# EAGLE schematic SI4844_LCD16x02_setup (EAGLE 9.6.2)
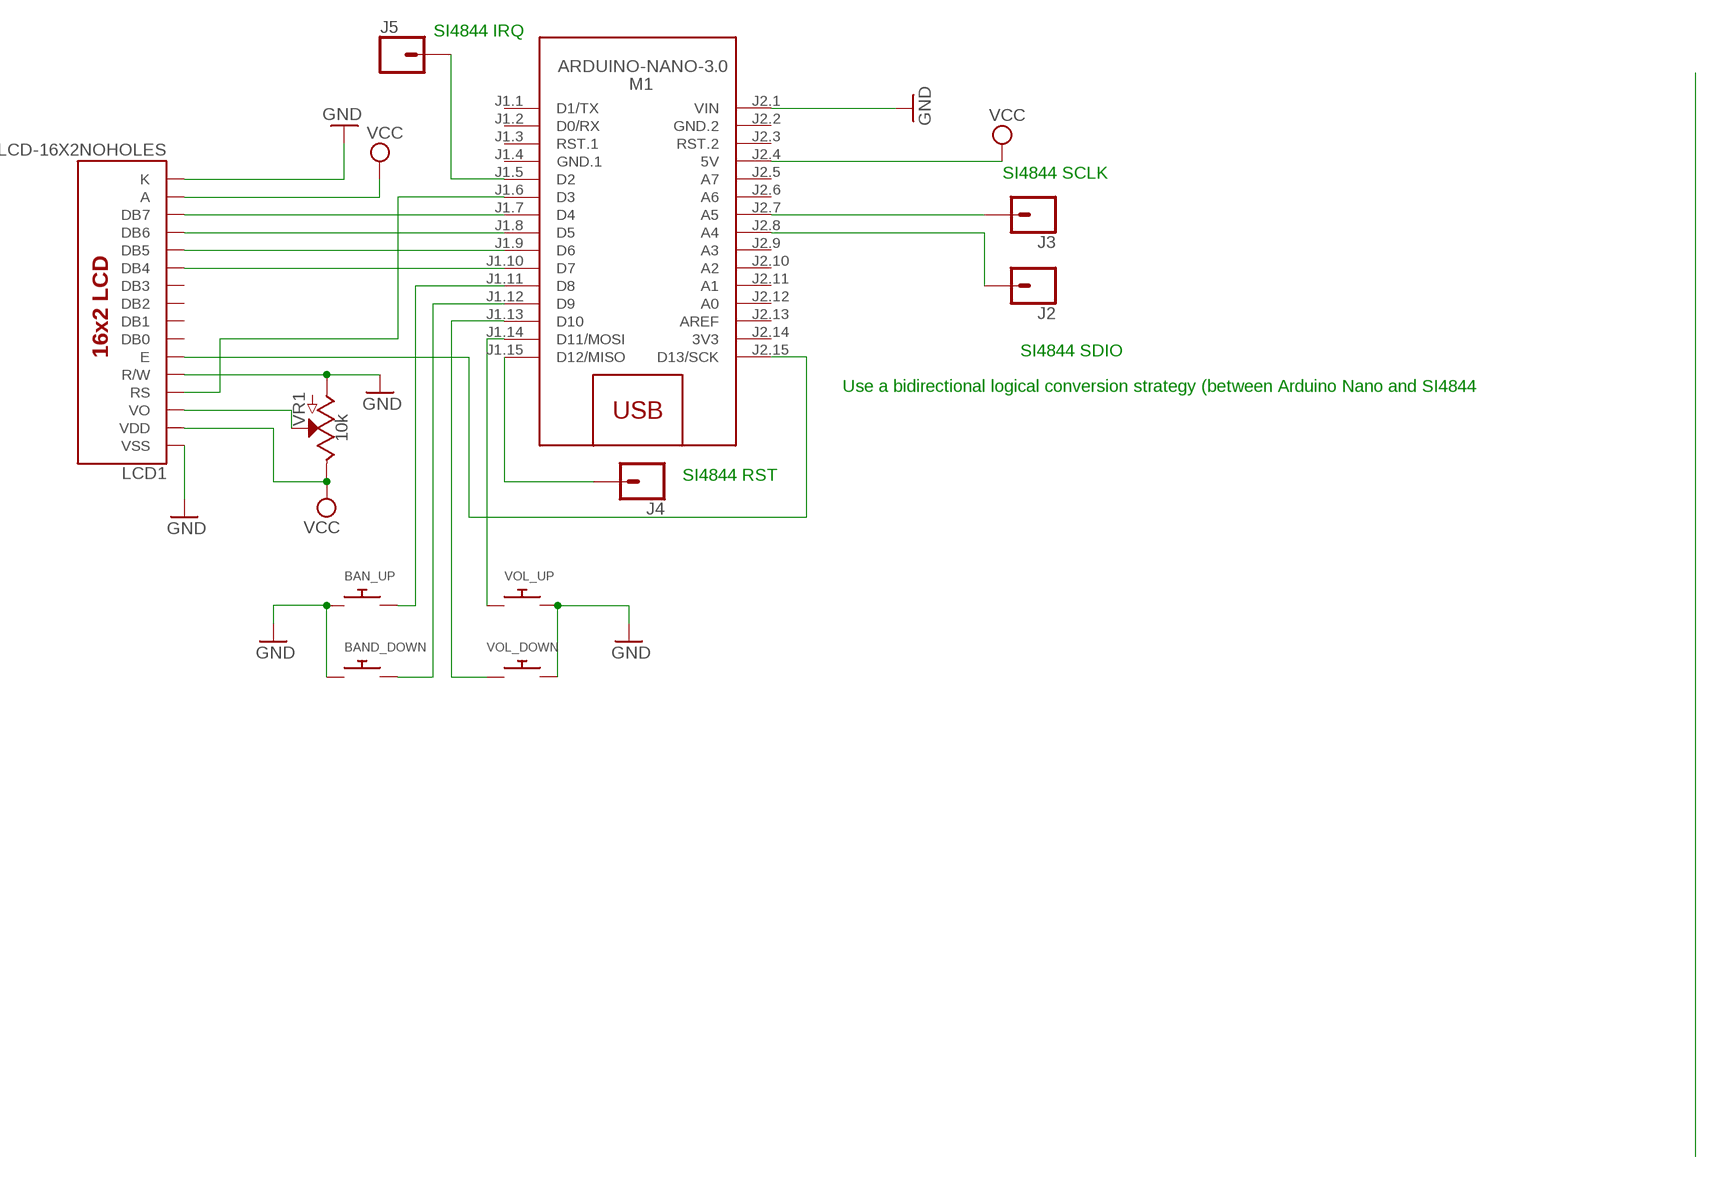
[diagram p0: schematic, sheet 1]

## Parts
BAN_UP  SWITCH_PUSHBUTTONC&K_KSS  [BTN_CK_KSS]
BAND_DOWN  SWITCH_PUSHBUTTONC&K_KSS  [BTN_CK_KSS]
J2  CONN_01  [1X01]
J3  CONN_01  [1X01]
J4  CONN_01  [1X01]
J5  CONN_01  [1X01]
LCD1  LCD-16X2NOHOLES  [LCD-16X2_NOHOLESNOSILK]
M1  ARDUINO-NANO-3.0  [ARDUINO-NANO-3.0]
VOL_DOWN  SWITCH_PUSHBUTTONC&K_KSS  [BTN_CK_KSS]
VOL_UP  SWITCH_PUSHBUTTONC&K_KSS  [BTN_CK_KSS]
VR1  10k  POTENTIOMETER-PTH-9MM-1/20W-20%  [POT-PTH-ALPS]

## Nets
GND: BAN_UP.P$1 BAND_DOWN.P$1 LCD1.1(VSS) LCD1.5(R/W) LCD1.16(K) M1.J2.1(VIN) VOL_DOWN.P$2 VOL_UP.P$2 VR1.P$3(A)
N$1: LCD1.14(DB7) M1.J1.7(D4)
N$2: LCD1.13(DB6) M1.J1.8(D5)
N$3: LCD1.12(DB5) M1.J1.9(D6)
N$4: LCD1.11(DB4) M1.J1.10(D7)
N$5: BAN_UP.P$2 M1.J1.11(D8)
N$6: LCD1.6(E) M1.J2.15(D13/SCK)
N$7: BAND_DOWN.P$2 M1.J1.12(D9)
N$8: M1.J1.13(D10) VOL_DOWN.P$1
N$9: M1.J1.14(D11/MOSI) VOL_UP.P$1
N$10: LCD1.3(VO) VR1.P$2(S)
N$11: LCD1.4(RS) M1.J1.6(D3)
N$12: J3.1 M1.J2.7(A5)
N$13: J2.1 M1.J2.8(A4)
N$14: J5.1 M1.J1.5(D2)
N$15: J4.1 M1.J1.15(D12/MISO)
VCC: LCD1.2(VDD) LCD1.15(A) M1.J2.4(5V) VR1.P$1(E)
Unconnected: LCD1.7(DB0) LCD1.8(DB1) LCD1.9(DB2) LCD1.10(DB3) M1.J1.1(D1/TX) M1.J1.2(D0/RX) M1.J1.3(RST.1) M1.J2.3(RST.2) M1.J2.5(A7) M1.J2.6(A6) M1.J2.9(A3) M1.J2.10(A2) M1.J2.11(A1) M1.J2.12(A0) M1.J2.13(AREF)

## Notes on the sheet
- SI4844 IRQ
- SI4844 SCLK
- SI4844 SDIO
- Use a bidirectional logical conversion strategy (between Arduino Nano and SI4844
- SI4844 RST

## Power pins joined to a net without a drawn wire
3V3: M1.J2.14(3V3)
GND.1: M1.J1.4(GND.1)
GND.2: M1.J2.2(GND.2)

## Library data of the parts
BAN_UP BAND_DOWN VOL_DOWN VOL_UP = adafruit:SWITCH_PUSHBUTTON: Buttons SOFTTOUCHSMD_SJ - Soft touch temporary push button (Super Junk Akihabara) Compatible with SKPMANE010 [Mouser: 688-SKPMAN] C&K_KSS = Digikey: KSS221GLFS
J2-J5 = SparkFun-Connectors:CONN_01: Single connection point. Often used as Generic Header-pin footprint for 0.1 inch spaced/style header connections On any of the 0.1 inch spaced packages, you can populate with these: Break Away Headers - Straight <https://www.sparkfun.com/products/116> (PRT-00116) Break Away Male Headers - Right Angle <https://www.sparkfun.com/products/553> (PRT-00553) Female Headers <https://www.sparkfun.com/products/115> (PRT-00115) Break Away Headers - Machine Pin <https://www.sparkfun.com/products/117> (PRT-00117) Break Away Female Headers - Swiss Machine Pin <https://www.sparkfun.com/products/743> (PRT-00743) This device is also useful as a general connection point to wire up your design to another part of your project. Our various solder wires solder well into these plated through hole pads. Hook-Up Wire - Assortment (Stranded, 22 AWG) <https://www.sparkfun.com/products/11375> (PRT-11375) Hook-Up Wire - Assortment (Solid Core, 22 AWG) <https://www.sparkfun.com/products/11367> (PRT-11367) View the entire wire category on our website here <https://www.sparkfun.com/categories/141> Special notes: SMTSO-256-ET is a "flush mount" nut for a 4-40 screw. We mostly use this on specialty testbeds; it is a nice way to connect hardware to your PCB at an adjustable hieght. Also note, the SNAP packages are for using a snappable style connector. We sell a baggie of snaps and they are also used on two LilyPad designs: Snap Assortment - 30 pack (male and female) <https://www.sparkfun.com/products/11347> (DEV-11347) LilyPad Arduino SimpleSnap <https://www.sparkfun.com/products/10941> (DEV-10941) LilyPad SimpleSnap Protoboard <https://www.sparkfun.com/products/10940> (DEV-10940)
LCD1 = SparkFun-Displays:LCD-16X2: Standard text-only 16x2 parallel input LCD Basic 16 character by 2 line display. Typically utilizes the extremely common HD44780 parallel interface chipset SparkFun Products: Basic 16x2 Green <https://www.sparkfun.com/products/255> Basic 8x2 Green <https://www.sparkfun.com/products/11122>; SF_ID: LCD-00255
M1 = diy-modules:ARDUINO-NANO-3.0: Arduino Nano 3.0 and compatible devices More details available here: https://www.arduino.cc/en/Main/ArduinoBoardNano Click here to find device on ebay.com <http://www.ebay.com/sch/arduino+nano>
VR1 = SparkFun-Resistors:POTENTIOMETER: Potentiometer (Pot) Three-terminal potentiometers, with an adjustable wiper and two adjustable resistors. A pot can be used to create a configurable voltage divider, or as a variable resistor. Variants ALPS_POT and ALPS_POT_KIT - PTH, breadboard compatible, 9mm square pots Rotary Potentiometer - Linear (10k ohm) <https://www.sparkfun.com/products/9288> (COM-09288) The KIT variant exposes copper on only one side of the PTH pad, so the part can only be assembled on one side of the PCB. Useful for beginner soldering kits.; PROD_ID: RES-09177; SF_SKU: COM-09288